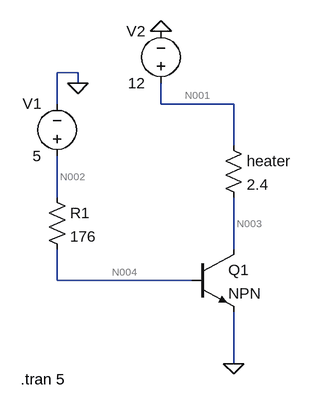
[diagram p0: schematic a1-2e.asc]
a1-2e.asc, the LTspice schematic file:
Version 4
SHEET 1 1380 680
WIRE 176 -304 144 -304
WIRE 176 -288 176 -304
WIRE 144 -256 144 -304
WIRE 304 -256 304 -288
WIRE 416 -256 304 -256
WIRE 416 -192 416 -256
WIRE 144 -112 144 -176
WIRE 416 -32 416 -112
WIRE 144 16 144 -32
WIRE 352 16 144 16
WIRE 416 144 416 64
FLAG 176 -288 0
FLAG 416 144 0
FLAG 304 -368 0
SYMBOL voltage 144 -160 R180
WINDOW 0 24 96 Left 2
WINDOW 3 24 16 Left 2
WINDOW 123 0 0 Left 0
WINDOW 39 0 0 Left 0
SYMATTR InstName V1
SYMATTR Value 5
SYMBOL res 128 -128 R0
SYMATTR InstName R1
SYMATTR Value 176
SYMBOL npn 352 -32 R0
SYMATTR InstName Q1
SYMBOL voltage 304 -272 R180
WINDOW 0 24 96 Left 2
WINDOW 3 24 16 Left 2
SYMATTR InstName V2
SYMATTR Value 12
SYMBOL res 400 -208 R0
SYMATTR InstName heater
SYMATTR Value 2.4
TEXT 88 168 Left 2 !.tran 5

The netlist it stands for:
* a1-2e.asc
V1 N002 0 5
R1 N002 N004 176
Q1 N003 N004 0 0 NPN
V2 N001 0 12
R§heater N001 N003 2.4
.model NPN NPN
.model PNP PNP
.lib standard.bjt
.tran 5
.backanno
.end

* Results of the author's LTspice run, read from the files saved beside the schematic
* Operating Point, zero values left out:
*   V(n002) = 5 V
*   V(n004) = 974.3 mV
*   V(n003) = 6.51 V
*   V(n001) = 12 V
*   Ic(Q1) = 2.287 A
*   Ib(Q1) = 22.87 mA
*   Ie(Q1) = -2.31 A
*   I(Heater) = 2.287 A
*   I(R1) = 22.87 mA
*   I(V2) = -2.287 A
*   I(V1) = -22.87 mA